# Altium project LED_panel.PrjPcb
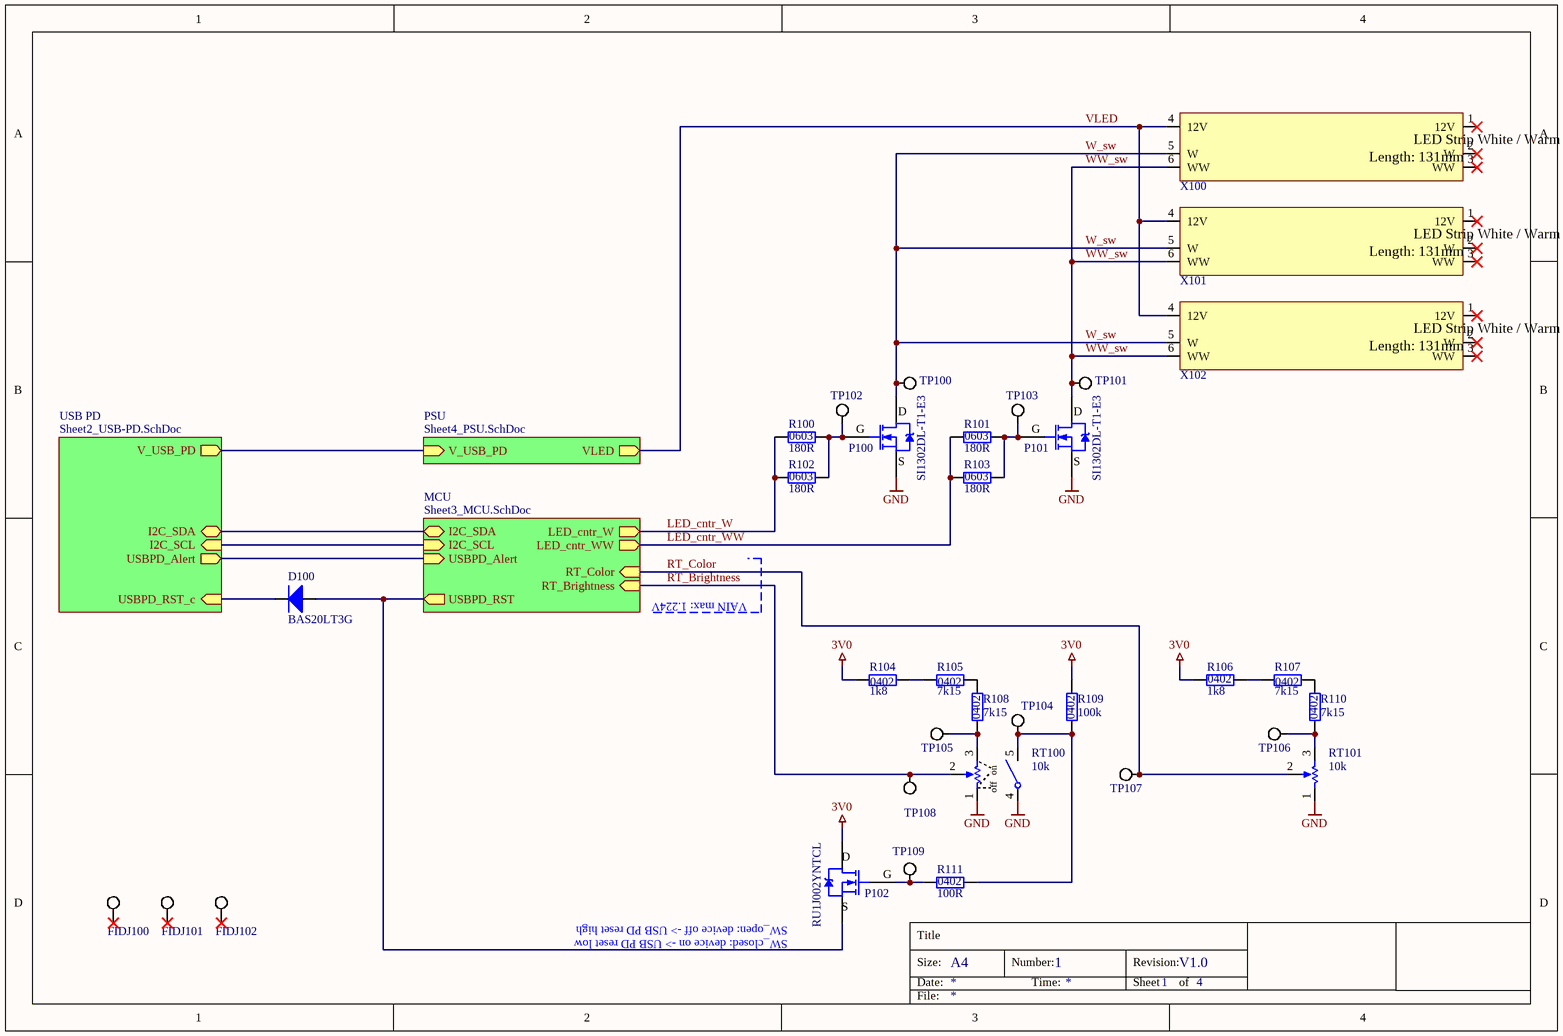
[diagram p0: Sheet1_Overview.SchDoc]
ProjectName: LED Panel; Revision: V1.0; Signature1: M.Tetard; Signature2: 2024-01 / Freiburg
4 sheets, 145 parts. Net scope: hierarchical (ports join the sheet entries above them; power ports are global).
Sheets:
  Sheet1_Overview.SchDoc
    USB PD = Sheet2_USB-PD.SchDoc
    MCU = Sheet3_MCU.SchDoc
    PSU = Sheet4_PSU.SchDoc

## Sheet Sheet1_Overview.SchDoc: =ProjectName
size A4; Organization: M.Tetard; Address1: 2024-01 / Freiburg; DocumentNumber: 1; Revision: V1.0; SheetNumber: 1; SheetTotal: 4

### Parts
D100  BAS20LT3G  [SOT-23-3]
FIDJ100  Fiducial  [FIDJ_1mm]  (value not drawn)  (net tie, no BOM)
FIDJ101  Fiducial  [FIDJ_1mm]  (value not drawn)  (net tie, no BOM)
FIDJ102  Fiducial  [FIDJ_1mm]  (value not drawn)  (net tie, no BOM)
P100  Manufacturer Part Number: SI1302DL-T1-E3  [SOT-323]  (hidden comment: P NMOS 30V 600mA)
P101  Manufacturer Part Number: SI1302DL-T1-E3  [SOT-323]  (hidden comment: P NMOS 30V 600mA)
P102  Manufacturer Part Number: RU1J002YNTCL  [UMT3F]  (hidden comment: P_NCH_50V_150mW)
R100  Resistance: 180R  Footprint: 0603  [R_0603]  (hidden comment: R 180R 0603)
R101  Resistance: 180R  Footprint: 0603  [R_0603]  (hidden comment: R 180R 0603)
R102  Resistance: 180R  Footprint: 0603  [R_0603]  (hidden comment: R 180R 0603)
R103  Resistance: 180R  Footprint: 0603  [R_0603]  (hidden comment: R 180R 0603)
R104  Resistance: 1k8  Footprint: 0402  [R_0402]  (hidden comment: R 1k8 0402)
R105  Resistance: 7k15  Footprint: 0402  [R_0402]  (hidden comment: R 7k15 0402)
R106  Resistance: 1k8  Footprint: 0402  [R_0402]  (hidden comment: R 1k8 0402)
R107  Resistance: 7k15  Footprint: 0402  [R_0402]  (hidden comment: R 7k15 0402)
R108  Resistance: 7k15  Footprint: 0402  [R_0402]  (hidden comment: R 7k15 0402)
R109  Resistance: 100k  Footprint: 0402  [R_0402]  (hidden comment: R 100k 0402)
R110  Resistance: 7k15  Footprint: 0402  [R_0402]  (hidden comment: R 7k15 0402)
R111  Resistance: 100R  Footprint: 0402  [R_0402]  (hidden comment: R 100R 0402)
RT100  10k  [RT_P091S-F*20]
RT101  10k  [RT_P091N-F*25]
TP100  TP  [TP_1mm]  (value not drawn)  (net tie, no BOM)
TP101  TP  [TP_1mm]  (value not drawn)  (net tie, no BOM)
TP102  TP  [TP_1mm]  (value not drawn)  (net tie, no BOM)
TP103  TP  [TP_1mm]  (value not drawn)  (net tie, no BOM)
TP104  TP  [TP_1mm]  (value not drawn)  (net tie, no BOM)
TP105  TP  [TP_1mm]  (value not drawn)  (net tie, no BOM)
TP106  TP  [TP_1mm]  (value not drawn)  (net tie, no BOM)
TP107  TP  [TP_1mm]  (value not drawn)  (net tie, no BOM)
TP108  TP  [TP_1mm]  (value not drawn)  (net tie, no BOM)
TP109  TP  [TP_1mm]  (value not drawn)  (net tie, no BOM)
X100  LED Strip  [LED_Strip_COB44-076]  (value not drawn)
X101  LED Strip  [LED_Strip_COB44-076]  (value not drawn)
X102  LED Strip  [LED_Strip_COB44-076]  (value not drawn)

### Sub-sheets
MCU = Sheet3_MCU.SchDoc: I2C_SCL (in), I2C_SDA (bidir), USBPD_Alert (in), USBPD_RST (out), LED_cntr_W (out), LED_cntr_WW (out), RT_Brightness (in), RT_Color (in)
PSU = Sheet4_PSU.SchDoc: V_USB_PD (in), VLED (out)
USB PD = Sheet2_USB-PD.SchDoc: USBPD_Alert (out), USBPD_RST_c (in), I2C_SDA (bidir), I2C_SCL (in), V_USB_PD (out)

### Nets
3V0: P102.3(D) R104.2 R106.1 R109.2
GND: P100.2(S) P101.2(S) RT100.1 RT100.4 RT101.1
I2C_SCL: sheet USB PD/I2C_SCL, sheet MCU/I2C_SCL
I2C_SDA: sheet USB PD/I2C_SDA, sheet MCU/I2C_SDA
LED_cntr_W: R100.1 R102.1 ; sheet MCU/LED_cntr_W
LED_cntr_WW: R101.1 R103.1 ; sheet MCU/LED_cntr_WW
RT_Brightness: RT100.2 TP108.1(TP) ; sheet MCU/RT_Brightness
RT_Color: RT101.2 TP107.1(TP) ; sheet MCU/RT_Color
USBPD_Alert: sheet USB PD/USBPD_Alert, sheet MCU/USBPD_Alert
USBPD_RST: D100.1(A) P102.2(S) ; sheet MCU/USBPD_RST
VLED: X100.4(12V) X101.4(12V) X102.4(12V) ; sheet PSU/VLED
W_sw: P100.3(D) TP100.1(TP) X100.5(W) X101.5(W) X102.5(W)
WW_sw: P101.3(D) TP101.1(TP) X100.6(WW) X101.6(WW) X102.6(WW)
NetC203_2: sheet USB PD/V_USB_PD, sheet PSU/V_USB_PD
NetD100_3: D100.3(K) ; sheet USB PD/USBPD_RST_c
NetP100_1: P100.1(G) R100.2 R102.2 TP102.1(TP)
NetP101_1: P101.1(G) R101.2 R103.2 TP103.1(TP)
NetP102_1: P102.1(G) R111.1 TP109.1(TP)
NetR104_1: R104.1 R105.2
NetR105_1: R105.1 R108.2
NetR106_2: R106.2 R107.2
NetR107_1: R107.1 R110.2
NetR108_1: R108.1 RT100.3 TP105.1(TP)
NetR109_1: R109.1 R111.2 RT100.5 TP104.1(TP)
NetR110_1: R110.1 RT101.3 TP106.1(TP)

Not connected (* = marked no-connect by the designer): FIDJ100 1*; FIDJ101 1*; FIDJ102 1*; X100 1(12V)* 2(W)* 3(WW)*; X101 1(12V)* 2(W)* 3(WW)*; X102 1(12V)* 2(W)* 3(WW)*

### Notes on the sheet
- VAIN max: 1.224V
- SW_open: device off -> USB PD reset high
- SW_closed: device on -> USB PD reset low
- Title
- Size:
- Date:
- A4
- Number:
- Time:
- Revision:
- Sheet
- of
- File:
- (in symbol LED_Strip_2WH_131mm) LED Strip White / Warm White; Length: 131mm
- (in symbol RT_10k_SW_V) on; off

### Library data of the parts
D100 = D_LL_200V_200mA: DIODE GP 200V 200MA SOT23-3; Manufacturer: onsemi; Type: Diode; Supplier 1: Digi-Key; Supplier Part Number 1: BAS20LT3GOSCT-ND; Manufacturer Part Number: BAS20LT3G
FIDJ100-FIDJ102 = FIDJ_1mm: Fiducal 1mm
P100 P101 = P_NCH_30V_280mW: MOSFET N-CH 30V 600MA SC70-3; Manufacturer: Vishay Siliconix; Type: Transistor; Supplier 1: Digi-Key; Supplier Part Number 1: SI1302DL-T1-E3CT-ND
P102 = P_NCH_50V_150mW: MOSFET N-CH 50V 200MA UMT3F; Manufacturer: Rohm Semiconductor; Type: Transistor; Supplier 1: Digi-Key; Supplier Part Number 1: RU1J002YNTCLCT-ND
R100-R103 = R_180R_0603: RES 180 OHM 1% 1/10W 0603; Manufacturer: Stackpole Electronics Inc; Manufacturer Part Number: RMCF0603FT180R; Type: Resistor; Supplier 1: Digi-Key; Supplier Part Number 1: RMCF0603FT180RCT-ND
R104 R106 = R_1k8_0402: RES 1.8K OHM 1% 1/16W 0402; Manufacturer: Stackpole Electronics Inc; Manufacturer Part Number: RMCF0402FT1K80; Type: Resistor; Supplier 1: Digi-Key; Supplier Part Number 1: RMCF0402FT1K80CT-ND
R105 R107 R108 R110 = R_7k15_0402: RES 7.15K OHM 1% 1/16W 0402; Manufacturer: Stackpole Electronics Inc; Manufacturer Part Number: RMCF0402FT7K15; Type: Resistor; Supplier 1: Digi-Key; Supplier Part Number 1: RMCF0402FT7K15CT-ND
R109 = R_100k_0402: RES 100K OHM 5% 1/16W 0402; Manufacturer: YAGEO; Manufacturer Part Number: RC0402JR-07100KL; Type: Resistor; Supplier 1: Digi-Key; Supplier Part Number 1: 311-100KJRCT-ND
R111 = R_100R_0402: RES 100 OHM 1% 1/16W 0402; Manufacturer: Stackpole Electronics Inc; Manufacturer Part Number: RMCF0402FT100R; Type: Resistor; Supplier 1: Digi-Key; Supplier Part Number 1: RMCF0402FT100RCT-ND
RT100 = RT_10k_SW_V: POT 10K OHM 1/20W PLASTIC LINEAR; Manufacturer: TT Electronics/BI; Manufacturer Part Number: P091S-FC20BR10K; Type: other, Poti; Supplier 1: Digi-Key; Supplier Part Number 1: 987-1283-ND
RT101 = RT_10k_V: POT 10K OHM 1/20W PLASTIC LINEAR; Manufacturer: TT Electronics/BI; Manufacturer Part Number: P091N-FC25BR10K; Type: other, Poti; Supplier 1: Digi-Key; Supplier Part Number 1: 987-1279-ND
TP100-TP109 = TP_1mm: Test Point 1mm
X100-X102 = LED_Strip_2WH_131mm: revoART, 12V COB LED Streifen - einstellbare Farbtemperatur - alle 1,3cm teilbar - 10mm breit; Manufacturer Part Number: COB44-076; Supplier 1: LED24; Supplier Part Number 1: COB44-076; Type: other; Manufacturer: revoART

## Sheet Sheet2_USB-PD.SchDoc: =ProjectName
size A4; Organization: M.Tetard; Address1: 2024-01 / Freiburg; DocumentNumber: 2; Revision: V1.0; SheetNumber: 2; SheetTotal: 4
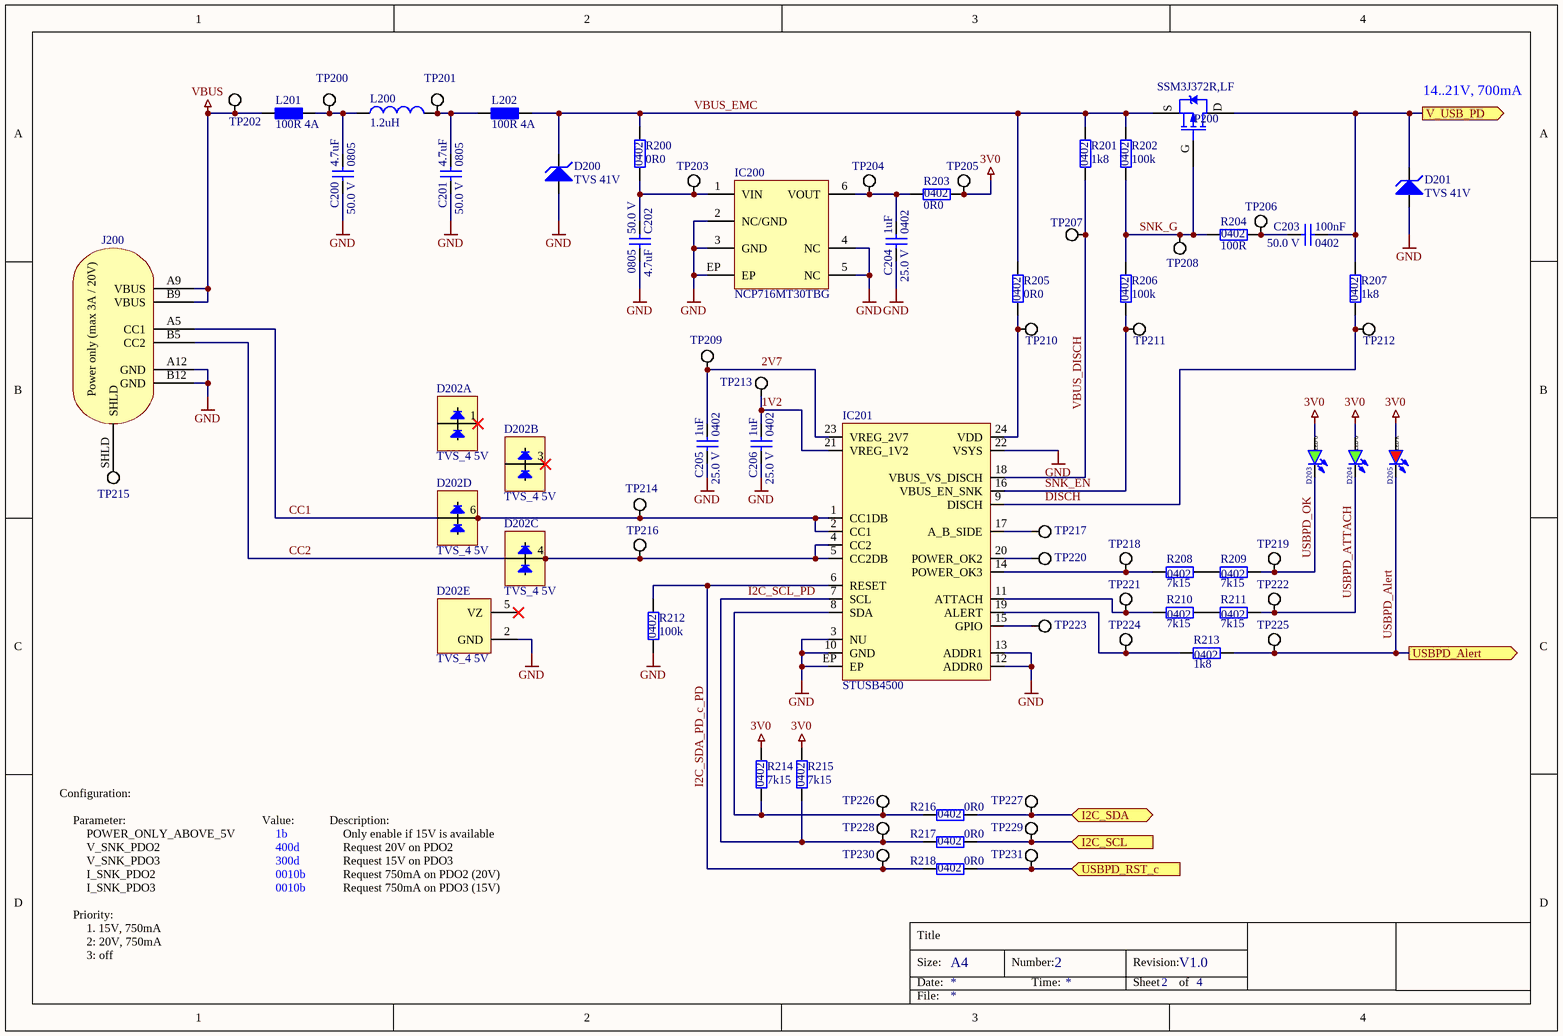
[diagram p1: Sheet2_USB-PD.SchDoc]

### Parts
C200  Capacitance: 4.7uF  Footprint: 0805  Voltage: 50.0 V  [C_0805]  (hidden comment: C 4.7uF 0805 50V)
C201  Capacitance: 4.7uF  Footprint: 0805  Voltage: 50.0 V  [C_0805]  (hidden comment: C 4.7uF 0805 50V)
C202  Capacitance: 4.7uF  Footprint: 0805  Voltage: 50.0 V  [C_0805]  (hidden comment: C 4.7uF 0805 50V)
C203  Capacitance: 100nF  Footprint: 0402  Voltage: 50.0 V  [C_0402]  (hidden comment: C 100nF 0402 50V)
C204  Capacitance: 1uF  Footprint: 0402  Voltage: 25.0 V  [C_0402]  (hidden comment: C 1uF 0402 25V)
C205  Capacitance: 1uF  Footprint: 0402  Voltage: 25.0 V  [C_0402]  (hidden comment: C 1uF 0402 25V)
C206  Capacitance: 1uF  Footprint: 0402  Voltage: 25.0 V  [C_0402]  (hidden comment: C 1uF 0402 25V)
D200  TVS 41V  [UDFN-2]
D201  TVS 41V  [UDFN-2]
D202  TVS_4 5V  [SOT-23-6]  (parts A,B,C,D,E of 5)
D203  LED G  [LED_0603]
D204  LED G  [LED_0603]
D205  LED R  [LED_0603]
IC200  NCP716MT30TBG  [WDFN-6_EP]
IC201  STUSB4500  [VFQFN-24]
J200  USB_C PWR  [J_TYPE-C-3_UJC-HP2-3]  (value not drawn)
L200  Inductance: 1.2uH  [L_3020]  (hidden comment: L 1.2uH 3.9A)
L201  Inductance: 100R 4A  [L_1206]  (hidden comment: L Ferrite 100R 4A)
L202  Inductance: 100R 4A  [L_1206]  (hidden comment: L Ferrite 100R 4A)
P200  Manufacturer Part Number: SSM3J372R,LF  [SOT-23-3-F]  (hidden comment: P PMOS 30V 6A)
R200  Resistance: 0R0  Footprint: 0402  [R_0402]  (hidden comment: R 0R0 0402)
R201  Resistance: 1k8  Footprint: 0402  [R_0402]  (hidden comment: R 1k8 0402)
R202  Resistance: 100k  Footprint: 0402  [R_0402]  (hidden comment: R 100k 0402)
R203  Resistance: 0R0  Footprint: 0402  [R_0402]  (hidden comment: R 0R0 0402)
R204  Resistance: 100R  Footprint: 0402  [R_0402]  (hidden comment: R 100R 0402)
R205  Resistance: 0R0  Footprint: 0402  [R_0402]  (hidden comment: R 0R0 0402)
R206  Resistance: 100k  Footprint: 0402  [R_0402]  (hidden comment: R 100k 0402)
R207  Resistance: 1k8  Footprint: 0402  [R_0402]  (hidden comment: R 1k8 0402)
R208  Resistance: 7k15  Footprint: 0402  [R_0402]  (hidden comment: R 7k15 0402)
R209  Resistance: 7k15  Footprint: 0402  [R_0402]  (hidden comment: R 7k15 0402)
R210  Resistance: 7k15  Footprint: 0402  [R_0402]  (hidden comment: R 7k15 0402)
R211  Resistance: 7k15  Footprint: 0402  [R_0402]  (hidden comment: R 7k15 0402)
R212  Resistance: 100k  Footprint: 0402  [R_0402]  (hidden comment: R 100k 0402)
R213  Resistance: 1k8  Footprint: 0402  [R_0402]  (hidden comment: R 1k8 0402)
R214  Resistance: 7k15  Footprint: 0402  [R_0402]  (hidden comment: R 7k15 0402)
R215  Resistance: 7k15  Footprint: 0402  [R_0402]  (hidden comment: R 7k15 0402)
R216  Resistance: 0R0  Footprint: 0402  [R_0402]  (hidden comment: R 0R0 0402)
R217  Resistance: 0R0  Footprint: 0402  [R_0402]  (hidden comment: R 0R0 0402)
R218  Resistance: 0R0  Footprint: 0402  [R_0402]  (hidden comment: R 0R0 0402)
TP200  TP  [TP_1mm]  (value not drawn)  (net tie, no BOM)
TP201  TP  [TP_1mm]  (value not drawn)  (net tie, no BOM)
TP202  TP  [TP_1mm]  (value not drawn)  (net tie, no BOM)
TP203  TP  [TP_1mm]  (value not drawn)  (net tie, no BOM)
TP204  TP  [TP_1mm]  (value not drawn)  (net tie, no BOM)
TP205  TP  [TP_1mm]  (value not drawn)  (net tie, no BOM)
TP206  TP  [TP_1mm]  (value not drawn)  (net tie, no BOM)
TP207  TP  [TP_1mm]  (value not drawn)  (net tie, no BOM)
TP208  TP  [TP_1mm]  (value not drawn)  (net tie, no BOM)
TP209  TP  [TP_1mm]  (value not drawn)  (net tie, no BOM)
TP210  TP  [TP_1mm]  (value not drawn)  (net tie, no BOM)
TP211  TP  [TP_1mm]  (value not drawn)  (net tie, no BOM)
TP212  TP  [TP_1mm]  (value not drawn)  (net tie, no BOM)
TP213  TP  [TP_1mm]  (value not drawn)  (net tie, no BOM)
TP214  TP  [TP_1mm]  (value not drawn)  (net tie, no BOM)
TP215  TP  [TP_1mm]  (value not drawn)  (net tie, no BOM)
TP216  TP  [TP_1mm]  (value not drawn)  (net tie, no BOM)
TP217  TP  [TP_1mm]  (value not drawn)  (net tie, no BOM)
TP218  TP  [TP_1mm]  (value not drawn)  (net tie, no BOM)
TP219  TP  [TP_1mm]  (value not drawn)  (net tie, no BOM)
TP220  TP  [TP_1mm]  (value not drawn)  (net tie, no BOM)
TP221  TP  [TP_1mm]  (value not drawn)  (net tie, no BOM)
TP222  TP  [TP_1mm]  (value not drawn)  (net tie, no BOM)
TP223  TP  [TP_1mm]  (value not drawn)  (net tie, no BOM)
TP224  TP  [TP_1mm]  (value not drawn)  (net tie, no BOM)
TP225  TP  [TP_1mm]  (value not drawn)  (net tie, no BOM)
TP226  TP  [TP_1mm]  (value not drawn)  (net tie, no BOM)
TP227  TP  [TP_1mm]  (value not drawn)  (net tie, no BOM)
TP228  TP  [TP_1mm]  (value not drawn)  (net tie, no BOM)
TP229  TP  [TP_1mm]  (value not drawn)  (net tie, no BOM)
TP230  TP  [TP_1mm]  (value not drawn)  (net tie, no BOM)
TP231  TP  [TP_1mm]  (value not drawn)  (net tie, no BOM)

### Ports
I2C_SCL (in), I2C_SDA (bidir), USBPD_Alert (out), USBPD_RST_c (in), V_USB_PD (out)

### Nets
3V0: D203.A D204.A D205.A R203.2 R214.2 R215.2 TP205.1(TP)
GND: C200.1 C201.1 C202.2 C204.1 C205.1 C206.1 D200.2(A) D201.2(A) D202.2(GND) IC200.2(NC/GND) IC200.3(GND) IC200.4(NC) IC200.5(NC) IC200.EP IC201.3(NU) IC201.10(GND) IC201.12(ADDR0) IC201.13(ADDR1) IC201.22(VSYS) IC201.EP J200.A12(GND) J200.B12(GND) R212.1
VBUS: J200.A9(VBUS) J200.B9(VBUS) L201.1 TP202.1(TP)
1V2: C206.2 IC201.21(VREG_1V2) TP213.1(TP)
2V7: C205.2 IC201.23(VREG_2V7) TP209.1(TP)
CC1: D202.6 IC201.1(CC1DB) IC201.2(CC1) J200.A5(CC1) TP214.1(TP)
CC2: D202.4 IC201.4(CC2) IC201.5(CC2DB) J200.B5(CC2) TP216.1(TP)
DISCH: IC201.9(DISCH) R207.1 TP212.1(TP)
I2C_SCL: R217.2 TP229.1(TP) ; port I2C_SCL
I2C_SCL_PD: IC201.7(SCL) R215.1 R217.1 TP228.1(TP)
I2C_SDA: R216.2 TP227.1(TP) ; port I2C_SDA
I2C_SDA_PD_c_PD: IC201.6(RESET) R212.2 R218.1 TP230.1(TP)
SNK_EN: IC201.16(VBUS_EN_SNK) R206.1 TP211.1(TP)
SNK_G: P200.1(G) R202.1 R204.1 R206.2 TP208.1(TP)
USBPD_Alert: D205.K R213.1 TP225.1(TP) ; port USBPD_Alert
USBPD_ATTACH: D204.K R211.1 TP222.1(TP)
USBPD_OK: D203.K R209.1 TP219.1(TP)
VBUS_DISCH: IC201.18(VBUS_VS_DISCH) R201.1 TP207.1(TP)
VBUS_EMC: D200.1(K) L202.2 P200.2(S) R200.2 R201.2 R202.2 R205.2
NetC200_2: C200.2 L200.1 L201.2 TP200.1(TP)
NetC201_2: C201.2 L200.2 L202.1 TP201.1(TP)
NetC202_1: C202.1 IC200.1(VIN) R200.1 TP203.1(TP)
NetC203_1: C203.1 R204.2 TP206.1(TP)
NetC203_2: C203.2 D201.1(K) P200.3(D) R207.2 ; port V_USB_PD
NetC204_2: C204.2 IC200.6(VOUT) R203.1 TP204.1(TP)
NetD100_3: R218.2 TP231.1(TP) ; port USBPD_RST_c
NetIC201_8: IC201.8(SDA) R214.1 R216.1 TP226.1(TP)
NetIC201_11: IC201.11(ATTACH) R210.2 TP221.1(TP)
NetIC201_14: IC201.14(POWER_OK3) R208.2 TP218.1(TP)
NetIC201_15: IC201.15(GPIO) TP223.1(TP)
NetIC201_17: IC201.17(A_B_SIDE) TP217.1(TP)
NetIC201_19: IC201.19(ALERT) R213.2 TP224.1(TP)
NetIC201_20: IC201.20(POWER_OK2) TP220.1(TP)
NetIC201_24: IC201.24(VDD) R205.1 TP210.1(TP)
NetJ200_SHLD: J200.SHLD TP215.1(TP)
NetR208_1: R208.1 R209.2
NetR210_1: R210.1 R211.2

Not connected (* = marked no-connect by the designer): D202 1* 3* 5(VZ)*

### Notes on the sheet
- 14..21V, 700mA
- Configuration:
- Parameter:
- POWER_ONLY_ABOVE_5V
- V_SNK_PDO2
- Value:
- 1b
- 400d
- Description:
- Only enable if 15V is available
- Request 20V on PDO2
- Priority:
- V_SNK_PDO3
- I_SNK_PDO2
- I_SNK_PDO3
- 300d
- 0010b
- Request 15V on PDO3
- Request 750mA on PDO2 (20V)
- Request 750mA on PDO3 (15V)
- 1. 15V, 750mA
- 2: 20V, 750mA
- 3: off
- Title
- Size:
- Date:
- A4
- Number:
- Time:
- Revision:
- Sheet
- of
- File:
- (in symbol J_USB-C_3) Power only (max 3A / 20V)

### Library data of the parts
C200-C202 = CAP_4.7uF_50V_0805: CAP CER 4.7UF 50V X5R 0805; Manufacturer: Samsung Electro-Mechanics; Manufacturer Part Number: CL21A475KBQNNNE; Type: Capacitor; Supplier 1: Digi-Key; Supplier Part Number 1: 1276-1248-1-ND
C203 = CAP_100nF_50V_0402: CAP CER 0.1UF 50V X7R 0402; Manufacturer: Murata Electronics; Manufacturer Part Number: GRM155R71H104KE14J; Type: Capacitor; Supplier 1: Digi-Key; Supplier Part Number 1: 490-13342-1-ND
C204-C206 = CAP_1uF_25V_0402: CAP CER 1UF 25V X5R 0402; Manufacturer: Taiyo Yuden; Manufacturer Part Number: TMK105BJ105MV-F; Type: Capacitor; Supplier 1: Digi-Key; Supplier Part Number 1: 587-3245-1-ND
D200 D201 = D_SCH_41V_35A: TVS DIODE 22VWM 41VC 1610; Manufacturer: STMicroelectronics; Manufacturer Part Number: ESDA25P35-1U1M; Type: Diode, TVS; Supplier 1: Digi-Key; Supplier Part Number 1: 497-16913-1-ND
D202 = D_TVS_U4_12V5: TVS DIODE 5VWM 12.5VC SOT23-6; Manufacturer: Comchip Technology; Manufacturer Part Number: CPDT6-5V0UPC-HF; Type: Diode, TVS; Supplier 1: Digi-Key; Supplier Part Number 1: 641-1829-1-ND
D203 D204 = D_LED_Green_0603: LED GREEN DIFFUSED 0603 SMD; Manufacturer: OSRAM Opto Semiconductors Inc.; Manufacturer Part Number: LT Q39G-Q1OO-25-1; Type: Diode, LED; Supplier 1: Digi-Key; Supplier Part Number 1: 475-3442-1-ND
D205 = D_LED_Red_0603: LED RED DIFFUSED 0603 SMD; Manufacturer: OSRAM Opto Semiconductors Inc.; Manufacturer Part Number: LS Q976-NR-1; Type: Diode, LED; Supplier 1: Digi-Key; Supplier Part Number 1: 475-2512-1-ND
IC200 = IC_Reg_NCP716MT30TBG: IC REG LINEAR 3V 80MA 6WDFN; Manufacturer: onsemi; Manufacturer Part Number: NCP716MT30TBG; Type: IC, Regulator; Supplier 1: Digi-Key; Supplier Part Number 1: 488-NCP716MT30TBGTR-ND
IC201 = IC_STUSB4500: IC USB CONTROLLER I2C 24QFN; Manufacturer: STMicroelectronics; Manufacturer Part Number: STUSB4500QTR; Type: IC; Supplier 1: Digi-Key; Supplier Part Number 1: 497-18060-2-ND
J200 = J_USB-C_3: TYPE C, 20 VDC, 3 A, RIGHT ANGLE; Manufacturer: CUI Devices; Manufacturer Part Number: UJC-HP2-3-SMT-TR; Type: Connector; Supplier 1: Digi-Key; Supplier Part Number 1: 2223-UJC-HP2-3-SMT-TR-ND; Pins: 6; Pitch: *
L200 = L_1.2uH_3.9A: FIXED IND 1.2UH 3.9A 36 MOHM SMD; Manufacturer: Würth Elektronik; Manufacturer Part Number: 74438336012; Type: Inductor; Supplier 1: Digi-Key; Supplier Part Number 1: 732-5694-1-ND
L201 L202 = L_100R_4A: FIXED IND 100 4000MA 1206; Manufacturer: Eaton - Electronics Division; Manufacturer Part Number: MFBM1V3216-101-R; Type: Inductor, Ferrite; Supplier 1: Digi-Key; Supplier Part Number 1: 283-MFBM1V3216-101-RCT-ND
P200 = P_PCH_30V_1W: MOSFET P-CH 30V 6A SOT23F; Manufacturer: Toshiba Semiconductor and Storage; Type: Transistor; Supplier 1: Digi-Key; Supplier Part Number 1: SSM3J372RLFCT-ND
R200 R203 R205 R216-R218 = R_0R0_0402: RES 0 OHM JUMPER 1/16W 0402; Manufacturer: Stackpole Electronics Inc; Manufacturer Part Number: RMCF0402ZT0R00; Type: Resistor; Supplier 1: Digi-Key; Supplier Part Number 1: RMCF0402ZT0R00CT-ND
R201 R207 R213 = R_1k8_0402: as R104 on sheet Sheet1_Overview; Type: Resistor; Supplier 1: Digi-Key; Supplier Part Number 1: RMCF0402FT1K80CT-ND
R202 R206 R212 = R_100k_0402: as R109 on sheet Sheet1_Overview; Type: Resistor; Supplier 1: Digi-Key; Supplier Part Number 1: 311-100KJRCT-ND
R204 = R_100R_0402: as R111 on sheet Sheet1_Overview; Type: Resistor; Supplier 1: Digi-Key; Supplier Part Number 1: RMCF0402FT100RCT-ND
R208-R211 R214 R215 = R_7k15_0402: as R105 on sheet Sheet1_Overview; Type: Resistor; Supplier 1: Digi-Key; Supplier Part Number 1: RMCF0402FT7K15CT-ND
TP200-TP231 = TP_1mm: Test Point 1mm

## Sheet Sheet3_MCU.SchDoc: =ProjectName
size A4; Organization: M.Tetard; Address1: 2024-01 / Freiburg; DocumentNumber: 3; Revision: V1.0; SheetNumber: 3; SheetTotal: 4
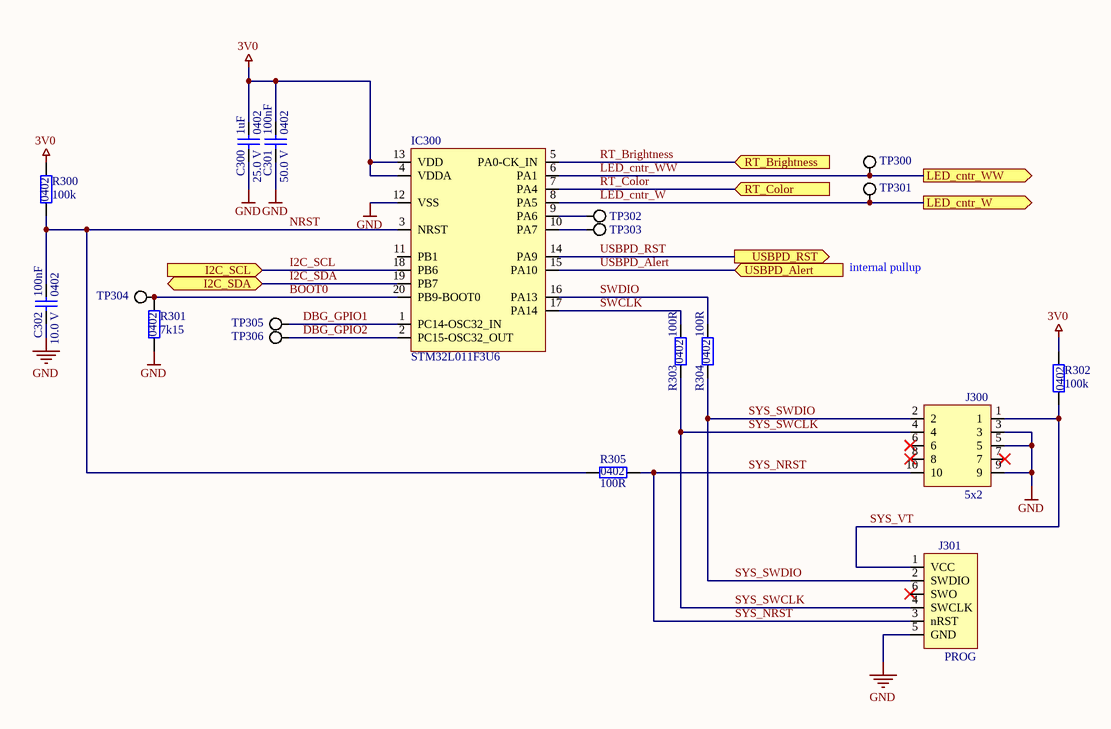
[diagram p2: Sheet3_MCU.SchDoc]

### Parts
C300  Capacitance: 1uF  Footprint: 0402  Voltage: 25.0 V  [C_0402]  (hidden comment: C 1uF 0402 25V)
C301  Capacitance: 100nF  Footprint: 0402  Voltage: 50.0 V  [C_0402]  (hidden comment: C 100nF 0402 50V)
C302  Capacitance: 100nF  Footprint: 0402  Voltage: 10.0 V  [C_0402]  (hidden comment: C 100nF 0402 10V)
IC300  STM32L011F3U6  [UFQFN-20]
J300  5x2  [J_MH5x2_1.27-STM32]
J301  PROG  [J_TC2030-IDC-NL]  (no BOM)
R300  Resistance: 100k  Footprint: 0402  [R_0402]  (hidden comment: R 100k 0402)
R301  Resistance: 7k15  Footprint: 0402  [R_0402]  (hidden comment: R 7k15 0402)
R302  Resistance: 100k  Footprint: 0402  [R_0402]  (hidden comment: R 100k 0402)
R303  Resistance: 100R  Footprint: 0402  [R_0402]  (hidden comment: R 100R 0402)
R304  Resistance: 100R  Footprint: 0402  [R_0402]  (hidden comment: R 100R 0402)
R305  Resistance: 100R  Footprint: 0402  [R_0402]  (hidden comment: R 100R 0402)
TP300  TP  [TP_1mm]  (value not drawn)  (net tie, no BOM)
TP301  TP  [TP_1mm]  (value not drawn)  (net tie, no BOM)
TP302  TP  [TP_1mm]  (value not drawn)  (net tie, no BOM)
TP303  TP  [TP_1mm]  (value not drawn)  (net tie, no BOM)
TP304  TP  [TP_1mm]  (value not drawn)  (net tie, no BOM)
TP305  TP  [TP_1mm]  (value not drawn)  (net tie, no BOM)
TP306  TP  [TP_1mm]  (value not drawn)  (net tie, no BOM)

### Ports
I2C_SCL (in), I2C_SDA (bidir), LED_cntr_W (out), LED_cntr_WW (out), RT_Brightness (in), RT_Color (in), USBPD_Alert (in), USBPD_RST (out)

### Nets
3V0: C300.2 C301.2 IC300.4(VDDA) IC300.13(VDD) R300.2 R302.1
GND: C300.1 C301.1 C302.1 IC300.12(VSS) J300.3 J300.5 J300.9 J301.5(GND) R301.1
BOOT0: IC300.20(PB9-BOOT0) R301.2 TP304.1(TP)
DBG_GPIO1: IC300.1(PC14-OSC32_IN) TP305.1(TP)
DBG_GPIO2: IC300.2(PC15-OSC32_OUT) TP306.1(TP)
I2C_SCL: IC300.18(PB6) ; port I2C_SCL
I2C_SDA: IC300.19(PB7) ; port I2C_SDA
LED_cntr_W: IC300.8(PA5) TP301.1(TP) ; port LED_cntr_W
LED_cntr_WW: IC300.6(PA1) TP300.1(TP) ; port LED_cntr_WW
NRST: C302.2 IC300.3(NRST) R300.1 R305.1
RT_Brightness: IC300.5(PA0-CK_IN) ; port RT_Brightness
RT_Color: IC300.7(PA4) ; port RT_Color
SWCLK: IC300.17(PA14) R303.2
SWDIO: IC300.16(PA13) R304.2
SYS_NRST: J300.10 J301.3(nRST) R305.2
SYS_SWCLK: J300.4 J301.4(SWCLK) R303.1
SYS_SWDIO: J300.2 J301.2(SWDIO) R304.1
SYS_VT: J300.1 J301.1(VCC) R302.2
USBPD_Alert: IC300.15(PA10) ; port USBPD_Alert
USBPD_RST: IC300.14(PA9) ; port USBPD_RST
NetIC300_9: IC300.9(PA6) TP302.1(TP)
NetIC300_10: IC300.10(PA7) TP303.1(TP)

Not connected (* = marked no-connect by the designer): IC300 11(PB1); J300 6* 7* 8*; J301 6(SWO)*

### Notes on the sheet
- internal pullup
- Title
- Size:
- Date:
- A4
- Number:
- Time:
- Revision:
- Sheet
- of
- File:

### Library data of the parts
C300 = CAP_1uF_25V_0402: as C204 on sheet Sheet2_USB-PD; Supplier 1: Digi-Key; Supplier Part Number 1: 587-3245-1-ND
C301 = CAP_100nF_50V_0402: as C203 on sheet Sheet2_USB-PD; Supplier 1: Digi-Key; Supplier Part Number 1: 490-13342-1-ND
C302 = CAP_100nF_10V_0402: CAP CER 0.1UF 10V X5R 0402; Manufacturer: Samsung Electro-Mechanics; Manufacturer Part Number: CL05A104MP5NNNC; Type: Capacitor; Supplier 1: Digi-Key; Supplier Part Number 1: 1276-1443-1-ND
IC300 = IC_MCU_STM32L011F3U6: IC MCU 32BIT 8KB FLASH 20UFQFPN; Manufacturer: STMicroelectronics; Manufacturer Part Number: STM32L011F3U6TR; Type: IC, MCU; Supplier 1: Digikey; Supplier Part Number 1: 497-18800-2-ND
J300 = J_MH5x2_1.27: CONN HEADER SMD 10POS 1.27MM; Manufacturer: Sullins Connector Solutions; Manufacturer Part Number: GRPB052VWQS-RC; Pitch: 1.27; Type: Connector; Supplier 1: Digi-Key; Supplier Part Number 1: S9012E-05-ND; Pins: 10
J301 = J_TC2030-IDC-NL: SWD Programmer No Legs; Manufacturer: Tag_connect; Manufacturer Part Number: TC2030; Type: Connector; Pins: 3
R300 R302 = R_100k_0402: as R109 on sheet Sheet1_Overview; Type: Resistor; Supplier 1: Digi-Key; Supplier Part Number 1: 311-100KJRCT-ND
R301 = R_7k15_0402: as R105 on sheet Sheet1_Overview; Type: Resistor; Supplier 1: Digi-Key; Supplier Part Number 1: RMCF0402FT7K15CT-ND
R303-R305 = R_100R_0402: as R111 on sheet Sheet1_Overview; Type: Resistor; Supplier 1: Digi-Key; Supplier Part Number 1: RMCF0402FT100RCT-ND
TP300-TP306 = TP_1mm: Test Point 1mm

## Sheet Sheet4_PSU.SchDoc: =ProjectName
size A4; Organization: M.Tetard; Address1: 2024-01 / Freiburg; DocumentNumber: 4; Revision: V1.0; SheetNumber: 4; SheetTotal: 4
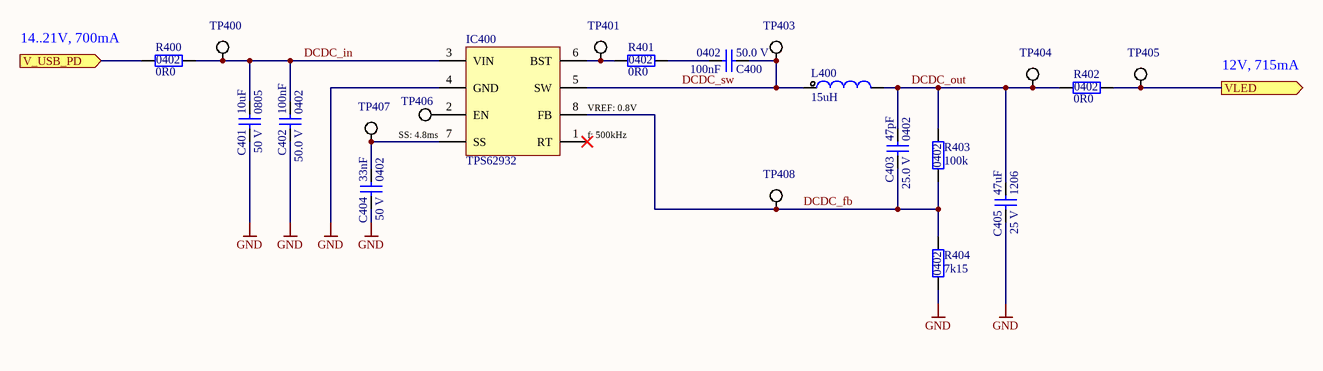
[diagram p3: Sheet4_PSU.SchDoc]

### Parts
C400  Capacitance: 100nF  Footprint: 0402  Voltage: 50.0 V  [C_0402]  (hidden comment: C 100nF 0402 50V)
C401  Capacitance: 10uF  Footprint: 0805  Voltage: 50 V  [C_0805]  (hidden comment: C 10uF 0805 50V)
C402  Capacitance: 100nF  Footprint: 0402  Voltage: 50.0 V  [C_0402]  (hidden comment: C 100nF 0402 50V)
C403  Capacitance: 47pF  Footprint: 0402  Voltage: 25.0 V  [C_0402]  (hidden comment: C 47pF 0402 25V)
C404  Capacitance: 33nF  Footprint: 0402  Voltage: 50 V  [C_0402]  (hidden comment: C 33nF 0402 50V)
C405  Capacitance: 47uF  Footprint: 1206  Voltage: 25 V  [C_1206]  (hidden comment: C 47uF 1206 25V)
IC400  TPS62932  [SOT-583]
L400  Inductance: 15uH  [L_7447709150]  (hidden comment: L 15uH 6.5A)
R400  Resistance: 0R0  Footprint: 0402  [R_0402]  (hidden comment: R 0R0 0402)
R401  Resistance: 0R0  Footprint: 0402  [R_0402]  (hidden comment: R 0R0 0402)
R402  Resistance: 0R0  Footprint: 0402  [R_0402]  (hidden comment: R 0R0 0402)
R403  Resistance: 100k  Footprint: 0402  [R_0402]  (hidden comment: R 100k 0402)
R404  Resistance: 7k15  Footprint: 0402  [R_0402]  (hidden comment: R 7k15 0402)
TP400  TP  [TP_1mm]  (value not drawn)  (net tie, no BOM)
TP401  TP  [TP_1mm]  (value not drawn)  (net tie, no BOM)
TP403  TP  [TP_1mm]  (value not drawn)  (net tie, no BOM)
TP404  TP  [TP_1mm]  (value not drawn)  (net tie, no BOM)
TP405  TP  [TP_1mm]  (value not drawn)  (net tie, no BOM)
TP406  TP  [TP_1mm]  (value not drawn)  (net tie, no BOM)
TP407  TP  [TP_1mm]  (value not drawn)  (net tie, no BOM)
TP408  TP  [TP_1mm]  (value not drawn)  (net tie, no BOM)

### Ports
V_USB_PD (in), VLED (out)

### Nets
GND: C401.1 C402.1 C404.1 C405.1 IC400.4(GND) R404.1
DCDC_fb: C403.1 IC400.8(FB) R403.1 R404.2 TP408.1(TP)
DCDC_in: C401.2 C402.2 IC400.3(VIN) R400.2 TP400.1(TP)
DCDC_out: C403.2 C405.2 L400.2 R402.1 R403.2 TP404.1(TP)
DCDC_sw: C400.1 IC400.5(SW) L400.1 TP403.1(TP)
VLED: R402.2 TP405.1(TP) ; port VLED
NetC203_2: R400.1 ; port V_USB_PD
NetC400_2: C400.2 R401.2
NetC404_2: C404.2 IC400.7(SS) TP407.1(TP)
NetIC400_2: IC400.2(EN) TP406.1(TP)
NetIC400_6: IC400.6(BST) R401.1 TP401.1(TP)

Not connected (* = marked no-connect by the designer): IC400 1(RT)*

### Notes on the sheet
- (near R400) 14..21V, 700mA
- VREF: 0.8V
- 12V, 715mA
- SS: 4.8ms
- (near IC400) f: 500kHz
- Title
- Size:
- Date:
- A4
- Number:
- Time:
- Revision:
- Sheet
- of
- File:

### Library data of the parts
C400 C402 = CAP_100nF_50V_0402: as C203 on sheet Sheet2_USB-PD; Supplier 1: Digi-Key; Supplier Part Number 1: 490-13342-1-ND
C401 = CAP_10uF_50V_0805: CAP CER 10UF 50V X5R 0805; Manufacturer: Murata Electronics; Manufacturer Part Number: GRM21BR61H106KE43K; Type: Capacitor; Supplier 1: Digi-Key; Supplier Part Number 1: 490-GRM21BR61H106KE43KTR-ND
C403 = CAP_47pF_25V_0402: CAP CER 47PF 25V C0G/NP0 0402; Manufacturer: KEMET; Manufacturer Part Number: C0402C470J3GAC7867; Type: Capacitor; Supplier 1: Digi-Key; Supplier Part Number 1: 399-C0402C470J3GAC7867CT-ND
C404 = CAP_33nF_50V_0402: CAP CER 0.033UF 50V X7R 0402; Manufacturer: Murata Electronics; Manufacturer Part Number: GCM155R71H333KE02J; Type: Capacitor; Supplier 1: Digi-Key; Supplier Part Number 1: 490-GCM155R71H333KE02JTR-ND
C405 = CAP_47uF_25V_1206: CAP CER 47UF 25V X5R 1206; Manufacturer: Murata Electronics; Manufacturer Part Number: GRM31CR61E476ME44K; Type: Capacitor; Supplier 1: Digi-Key; Supplier Part Number 1: GRM31CR61E476ME44K
IC400 = IC_Reg_TPS62932DRLR: IC REG BUCK ADJ 2A SOT583; Manufacturer: Texas Instruments; Manufacturer Part Number: TPS62932DRLR; Type: IC, Regulator; Supplier 1: Digi-Key; Supplier Part Number 1: 296-TPS62932DRLRTR-ND
L400 = L_15uH_6.5A: FIXED IND 15UH 6.5A 26 MOHM SMD; Manufacturer: Würth Elektronik; Manufacturer Part Number: 7447709150; Type: Inductor; Supplier 1: Digi-Key; Supplier Part Number 1: 732-7447709150TR-ND
R400-R402 = R_0R0_0402: as R200 on sheet Sheet2_USB-PD; Type: Resistor; Supplier 1: Digi-Key; Supplier Part Number 1: RMCF0402ZT0R00CT-ND
R403 = R_100k_0402: as R109 on sheet Sheet1_Overview; Type: Resistor; Supplier 1: Digi-Key; Supplier Part Number 1: 311-100KJRCT-ND
R404 = R_7k15_0402: as R105 on sheet Sheet1_Overview; Type: Resistor; Supplier 1: Digi-Key; Supplier Part Number 1: RMCF0402FT7K15CT-ND
TP400 TP401 TP403-TP408 = TP_1mm: Test Point 1mm

## Nets that join several sheets
3V0: Sheet1_Overview (P102.3 R104.2 R106.1 R109.2), Sheet2_USB-PD (7 pins), Sheet3_MCU (6 pins)
GND: Sheet1_Overview (5 pins), Sheet2_USB-PD (23 pins), Sheet3_MCU (9 pins), Sheet4_PSU (6 pins)
I2C_SCL: Sheet2_USB-PD (R217.2 TP229.1), Sheet3_MCU (IC300.18)
I2C_SDA: Sheet2_USB-PD (R216.2 TP227.1), Sheet3_MCU (IC300.19)
LED_cntr_W: Sheet1_Overview (R100.1 R102.1), Sheet3_MCU (IC300.8 TP301.1)
LED_cntr_WW: Sheet1_Overview (R101.1 R103.1), Sheet3_MCU (IC300.6 TP300.1)
NetC203_2: Sheet2_USB-PD (C203.2 D201.1 P200.3 R207.2), Sheet4_PSU (R400.1)
NetD100_3: Sheet1_Overview (D100.3), Sheet2_USB-PD (R218.2 TP231.1)
RT_Brightness: Sheet1_Overview (RT100.2 TP108.1), Sheet3_MCU (IC300.5)
RT_Color: Sheet1_Overview (RT101.2 TP107.1), Sheet3_MCU (IC300.7)
USBPD_Alert: Sheet2_USB-PD (D205.K R213.1 TP225.1), Sheet3_MCU (IC300.15)
USBPD_RST: Sheet1_Overview (D100.1 P102.2), Sheet3_MCU (IC300.14)
VLED: Sheet1_Overview (X100.4 X101.4 X102.4), Sheet4_PSU (R402.2 TP405.1)

## Assembly variants
Variant1: all parts fitted